# EAGLE design elderstep (EAGLE 8.3.2)
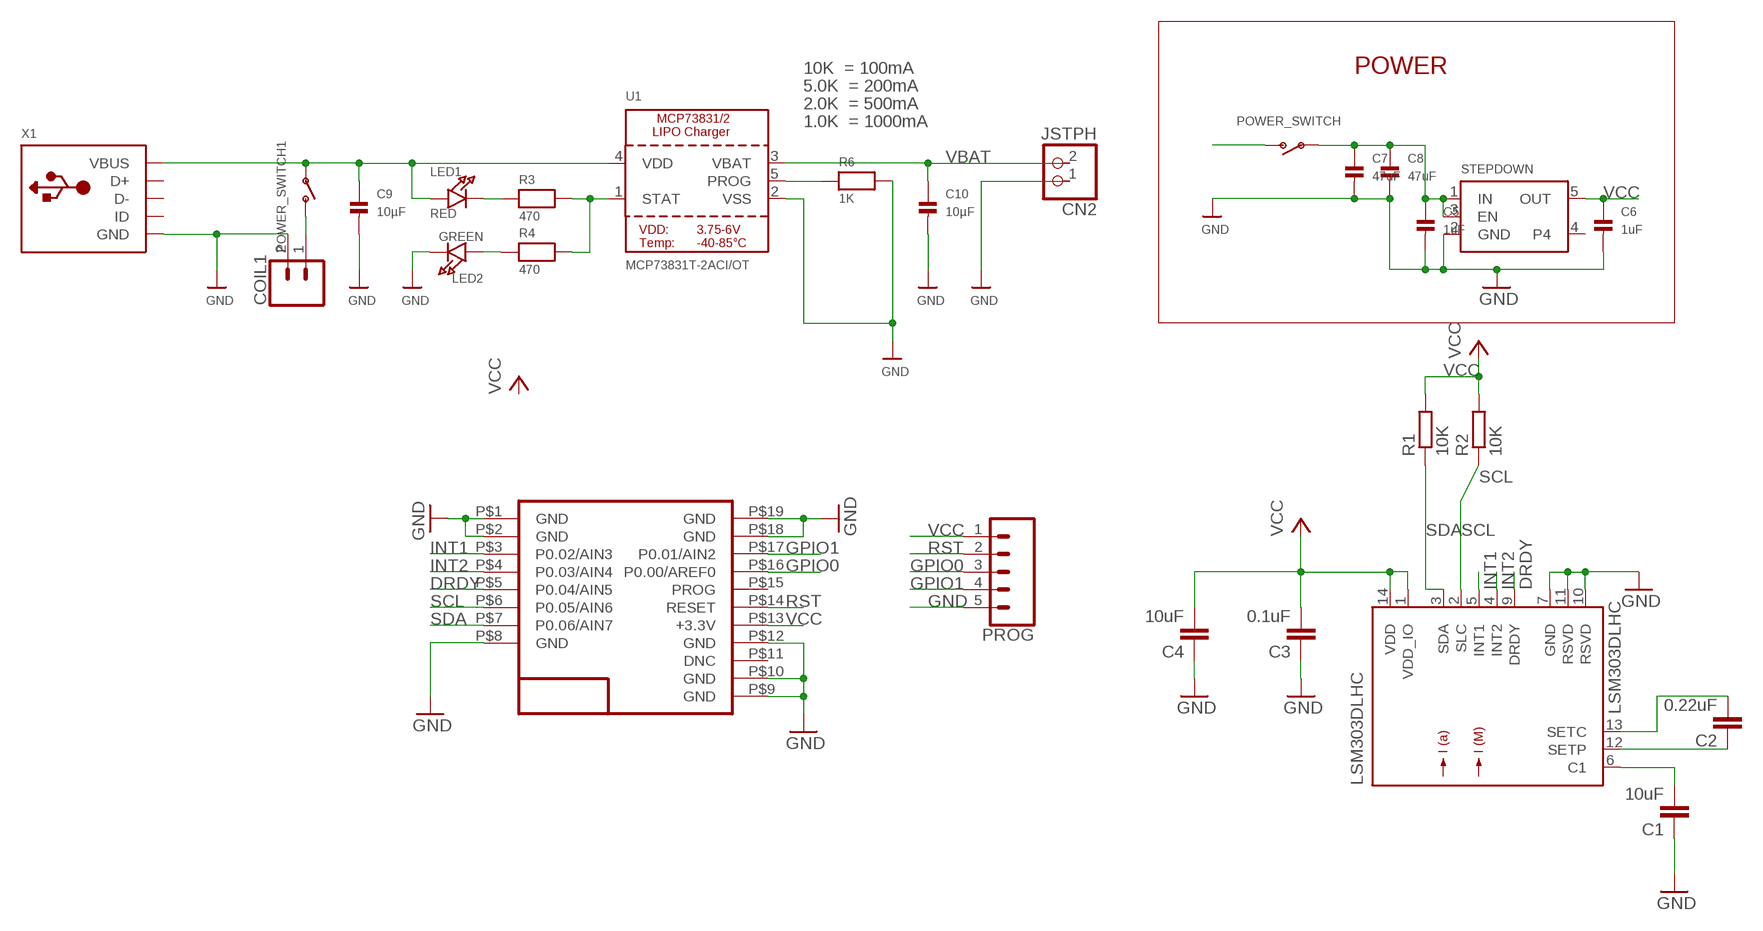
[diagram p0: schematic, sheet 1]

## Parts
C1  10uF  C-EUC0805  [C0805]
C2  0.22uF  C-EUC0805  [C0805]
C3  0.1uF  C-EUC0805  [C0805]
C4  10uF  C-EUC0805  [C0805]
C5  1uF  CAP_CERAMIC0603  [0603]
C6  1uF  CAP_CERAMIC0603  [0603]
C7  47uF  CAP_CERAMIC0805  [0805]
C8  47uF  CAP_CERAMIC0805  [0805]
C9  10µF  CAP_CERAMIC0805  [0805]
C10  10µF  CAP_CERAMIC0805  [0805]
CN2  JSTPH  JST_2PIN  [JSTPH2]
COIL1  CONN_02  [1X02]
LED1  RED  LED0805  [CHIPLED_0805]
LED2  GREEN  LED0805  [CHIPLED_0805]
LSM303DLHC  LSM303DLHC  [LGA-14]
POWER_SWITCH  SWITCH_SPST  [SPST_SMT_19192]
POWER_SWITCH1  SWITCH_SPST  [SPST_SMT_19192]
PROG  CONN_05  [1X05]
R1  10K  R-EU_R0805  [R0805]
R2  10K  R-EU_R0805  [R0805]
R3  470  RESISTOR0805  [0805]
R4  470  RESISTOR0805  [0805]
R6  1K  RESISTOR0805  [0805]
RFD22301  RFD22301  [RFD21733]
STEPDOWN  VREG_SOT23-5  [SOT23-5]
U1  MCP73831T-2ACI/OT  MCP73831/2  [SOT23-5]
X1  USBMICRO_20329  [4UCONN_20329]

## Nets
DRDY: LSM303DLHC.9(DRDY) RFD22301.P$5(P0.04/AIN5)
GND: C1.1 C3.1 C4.1 C5.2 C6.2 C7.2 C8.2 C9.2 C10.2 CN2.1 COIL1.2 LED2.C LSM303DLHC.7(GND) LSM303DLHC.10(RSVD) LSM303DLHC.11(RSVD) PROG.5 R6.2 RFD22301.P$1(GND) RFD22301.P$2(GND) RFD22301.P$8(GND) RFD22301.P$9(GND) RFD22301.P$10(GND) RFD22301.P$12(GND) RFD22301.P$18(GND) RFD22301.P$19(GND) STEPDOWN.2(GND) U1.2(VSS) X1.BASE@1(GND) X1.BASE@2(GND) X1.GND X1.SPRT@1(GND) X1.SPRT@2(GND) X1.SPRT@3(GND) X1.SPRT@4(GND)
GPIO0: PROG.3 RFD22301.P$16(P0.00/AREF0)
GPIO1: PROG.4 RFD22301.P$17(P0.01/AIN2)
INT1: LSM303DLHC.5(INT1) RFD22301.P$3(P0.02/AIN3)
INT2: LSM303DLHC.4(INT2) RFD22301.P$4(P0.03/AIN4)
N$1: LED1.C R3.1
N$2: R3.2 R4.2 U1.1(STAT)
N$3: C1.2 LSM303DLHC.6(C1)
N$4: C2.2 LSM303DLHC.13(SETC)
N$5: C2.1 LSM303DLHC.12(SETP)
N$6: R6.1 U1.5(PROG)
N$7: LED2.A R4.1
N$8: COIL1.1 POWER_SWITCH1.C(S)
RST: PROG.2 RFD22301.P$14(RESET)
SCL: LSM303DLHC.2(SLC) R2.1 RFD22301.P$6(P0.05/AIN6)
SDA: LSM303DLHC.3(SDA) R1.1 RFD22301.P$7(P0.06/AIN7)
SWITCH_OUT: C5.1 C7.1 C8.1 POWER_SWITCH.B(P) STEPDOWN.1(IN) STEPDOWN.3(EN)
VBAT: C10.1 CN2.2 POWER_SWITCH.C(S) U1.3(VBAT)
VCC: C3.2 C4.2 C6.1 LSM303DLHC.1(VDD_IO) LSM303DLHC.14(VDD) PROG.1 R1.2 R2.2 RFD22301.P$13(+3.3V) STEPDOWN.5(OUT)
VDD: C9.1 LED1.A POWER_SWITCH1.B(P) U1.4(VDD) X1.VBUS
Unconnected: RFD22301.P$11(DNC) RFD22301.P$15(PROG) STEPDOWN.4 X1.D+ X1.D- X1.ID

## Notes on the sheet
- 10K  = 100mA | POWER
- 5.0K  = 200mA
- 2.0K  = 500mA
- 1.0K  = 1000mA

## Library data of the parts
C1-C4 = rcl:C-EU: CAPACITOR, European symbol
C5-C10 = microbuilder:CAP_CERAMIC: Ceramic Capacitors 0402 - 0402 Surface Mount Capacitors 16pF 50V 5% [Digikey: 445-4899-2-ND] 18pF 50V 5% [Digikey: 490-1281-2-ND] 22pF 50V 5% [Digikey: 490-1283-2-ND] 68pF 50V 5% [Digikey: 490-1289-2-ND] 0.1uF 10V 10% [Digikey: 490-1318-2-ND] 1.0uF 6.3V 10% [Digikey: 490-1320-2-ND] 0603 - 0603 Surface Mount Capacitors 16 pF 50V 5% [Digikey: 445-5051-2-ND] 22 pF 50V [Digikey: PCC220ACVTR-ND] 33 pF 50V 5% [Digikey: 490-1415-1-ND] 56pF 50V 5% [Digikey: 490-1421-1-ND] 220pF 50V 5% [Digikey: 445-1285-1-ND] 680 pF 50V 2200 pF 50V 5% C0G [Digikey: 445-1297-1-ND] 5600 pF 100V 5% X7R [Digikey: 478-3711-1-ND] 0.1 µF 25V 10% [Digikey: PCC2277TR-ND] 0.22 µF 16V 10% X7R [Digikey: 445-1318-1-ND] 1.0 µF 25V 10% [Digikey: 445-5146-2-ND] 0603 - RF Specific 3pF 250V +/-0.1pF RF [Digikey: 712-1347-1-ND] 18 pF 250V 5% [Digikey: 478-3505-1-ND or 712-1322-1-ND] 56 pF 250V 5% C0G RF [Digikey: 490-4867-1-ND] 68 pF 250V RF [Digikey: 490-4868-1-ND] 0805 - 0805 Surface Mount Capacitors 220 pF 250V 2% RF Ceramic Capacitor [Digikey: 712-1398-1-ND] 1000 pF 50V 2% NP0 Ceramic Capacitor [Digikey: 478-3760-1-ND] 0.1 µF 25V 10% Ceramic Capacitor [Digikey: PCC1828TR-ND] 1.0 µF 16V 10% Ceramic Capacitor[Digikey: 490-1691-2-ND] 10.0 µF 10V 10% Ceramic Capacitor[Digikey: 709-1228-1-ND] 10.0 uF 16V 10% Ceramic Capacitor [Digikey: 478-5165-2-ND] 47 uF 6.3V 20% Ceramic Capacitor [Digikey: 587-1779-1-ND or 399-5506-1-ND] 1206 - 1206 Surface Mount Capacitors 47uF 10V 20% Ceramic Capacitor [Digikey: 490-5528-1-ND or 399-5508-1-ND or 445-6010-1-ND] 100uF 6.3V -20%, +80% Y5V Ceramic Capacitor (Digikey: 490-4512-1-ND, Mouser: 81-GRM31CF50J107ZE1L)
CN2 = microbuilder:JST_2PIN: JST 2-Pin Right-Angle Connector PH-Series - 4UConnector: 17311 SH-Series - 4UConnector: 07278
COIL1 = SparkFun-Connectors:CONN_02: Multi connection point. Often used as Generic Header-pin footprint for 0.1 inch spaced/style header connections On any of the 0.1 inch spaced packages, you can populate with these: Break Away Headers - Straight <https://www.sparkfun.com/products/116> (PRT-00116) Break Away Male Headers - Right Angle <https://www.sparkfun.com/products/553> (PRT-00553) Female Headers <https://www.sparkfun.com/products/115> (PRT-00115) Break Away Headers - Machine Pin <https://www.sparkfun.com/products/117> (PRT-00117) Break Away Female Headers - Swiss Machine Pin <https://www.sparkfun.com/products/743> (PRT-00743) For SCREWTERMINALS and SPRING TERMINALS visit here: Screw Terimnals on SparkFun.com <https://www.sparkfun.com/search/results?term=Screw+Terminals> (5mm/3.5mm/2.54mm spacing) This device is also useful as a general connection point to wire up your design to another part of your project. Our various solder wires solder well into these plated through hole pads. Hook-Up Wire - Assortment (Stranded, 22 AWG) <https://www.sparkfun.com/products/11375> (PRT-11375) Hook-Up Wire - Assortment (Solid Core, 22 AWG) <https://www.sparkfun.com/products/11367> (PRT-11367) View the entire wire category on our website here <https://www.sparkfun.com/categories/141> Special notes: Molex polarized connector foot print use with: PRT-08233 with associated crimp pins and housings. 2.54_SCREWTERM for use with PRT-10571. 3.5mm Screw Terminal footprints for PRT-08084 5mm Screw Terminal footprints for use with PRT-08432
LED1 LED2 = microbuilder:LED: LED 0603 - 0603 Surface Mount Package 2mA: Green LED - Low Power (3.9mcd, 2ma, 1.7Vf) - Digikey: 475-2709-2-ND Orange LED - Low Power (9.8mcd, 2ma, 1.8Vf) - Digikey: 475-1194-2-ND Red LED - Low Power (5mcd, 2ma, 1.8Vf) - Digikey: 475-1195-2-ND Yellow LED - Low Power (7mcd, 2ma, 1.8Vf) - Digikey: 475-1196-2-ND 5mA: Blue LED - Low Power (17mcd, 5ma, 2.9Vf) - Digikey: LNJ937W8CRACT-ND 0805 - 0805 Surface Mount Package 2mA: Red LED (8.8mcd, 2mA, 1.8Vf, Clear) - Low Power [Digikey: 475-2510-1-ND] Green LED (5mcd, 2mA, 1.8Vf, Clear) - Low Power [Digikey: 475-2730-1-ND] Yellow LED (11.3mcd, 2mA, 1.8Vf, Clear) - Low Power [Digikey: 475-2555-1-ND] 20mA: Red LED (104mcd, 20mA, Diffused) - LS R976 [Digikey: 475-1278-6-ND] Red LED (12mcd, 20mA, 2.0Vf, Clear) - APT2012EC [Digikey: 754-1128-1-ND] Green LED (15mcd, 20mA, 2.2Vf, Clear) - APT2012GC [Digikey: 754-1131-1-ND] Orange LED (160mcd, 20mA, 2.1Vf, Clear) - APT2012SECK [Digikey: 754-1130-1-ND] 1206 - 1206 Surface Mount Package Green LED (26mcd, 20mA, Diffused) - LG N971 [Digikey: 475-1407-6-ND] Red LED (15mcd, 20mA, Diffused) - LH N974 [Digikey: 475-1416-6-ND] Cree - Cree High-Power Surface Mount LEDs XPEBWT-L1-0000-00D50 - White 111lm 350mA 2.9Vf 6200K 110° XTEAWT-00-0000-00000LEE3 - White 114lm 350mA 2.85Vf 5000K 115°
LSM303DLHC = st-microelectronics:LSM303DLHC: Ultra compact high performance e-compass, 3D accelerometer and 3D magnetometer module Source: DM00027543-118326.pdf
POWER_SWITCH POWER_SWITCH1 = microbuilder:SWITCH_SPST: Switch - SPST 4UCon 19192 (6.7x2.6mm SMT)
PROG = SparkFun-Connectors:CONN_05: Multi connection point. Often used as Generic Header-pin footprint for 0.1 inch spaced/style header connections On any of the 0.1 inch spaced packages, you can populate with these: Break Away Headers - Straight <https://www.sparkfun.com/products/116> (PRT-00116) Break Away Male Headers - Right Angle <https://www.sparkfun.com/products/553> (PRT-00553) Female Headers <https://www.sparkfun.com/products/115> (PRT-00115) Break Away Headers - Machine Pin <https://www.sparkfun.com/products/117> (PRT-00117) Break Away Female Headers - Swiss Machine Pin <https://www.sparkfun.com/products/743> (PRT-00743) For SCREWTERMINALS and SPRING TERMINALS visit here: Screw Terimnals on SparkFun.com <https://www.sparkfun.com/search/results?term=Screw+Terminals> (5mm/3.5mm/2.54mm spacing) This device is also useful as a general connection point to wire up your design to another part of your project. Our various solder wires solder well into these plated through hole pads. Hook-Up Wire - Assortment (Stranded, 22 AWG) <https://www.sparkfun.com/products/11375> (PRT-11375) Hook-Up Wire - Assortment (Solid Core, 22 AWG) <https://www.sparkfun.com/products/11367> (PRT-11367) View the entire wire category on our website here <https://www.sparkfun.com/categories/141> Special notes: Molex polarized connector foot print use with SKU : PRT-08231 with associated crimp pins and housings. 1MM SMD Version SKU: PRT-10208
R1 R2 = resistor:R-EU_: RESISTOR, European symbol
R3 R4 R6 = microbuilder:RESISTOR: Resistors 0402 - 0402 Surface Mount Package 22 Ohm 1% 1/16W [Digikey: 311-22.0LRTR-ND] 33 Ohm 5% 1/16W 1.0K 5% 1/16W 1.5K 5% 1/16W 2.0K 1% 1/16W 10.0K 1% 1/16W [Digikey: 311-10.0KLRTR-ND] 10.0K 5% 1/16W [Digikey: RMCF0402JT10K0TR-ND] 12.1K 1% 1/16W [Digikey: 311-22.0LRTR-ND] 100.0K 5% 1/16W 0603 - 0603 Surface Mount Package 0 Ohm 1/10 Watt 1% Resistor 15 Ohm 1/10 Watt 1% Resistor 33 Ohm 1/10 Watt 1% Resistor 49.9 Ohm 1/10 Watt 1% Resistor 100 Ohm 1/10 Watt 1% Resistor 150 Ohm 1/10 Watt 1% Resistor 240 Ohm 1/10 Watt 1% Resistor 390 Ohm 1/10 Watt 1% Resistor 560 Ohm 1/10 Watt 1% Resistor 680 Ohm 1/10 Watt 1% Resistor 750 Ohm 1/10 Watt 1% Resistor 1.0K Ohm 1/10 Watt 1% Resistor 1.5K Ohm 1/10 Watt 1% Resistor 2.0K Ohm 1/10 Watt 1% Resistor 2.2K Ohm 1/10 Watt 1% Resistor 3.3K Ohm 1/10 Watt 1% Resistor 4.7K Ohm 1/10 Watt 1% Resistor 10.0K Ohm 1/10 Watt 1% Resistor 12.0K Ohm 1/10 Watt 1% Resistor 12.1K Ohm 1/10 Watt 1% Resistor 20.0K Ohm 1/10 Watt 1% Resistor 33.0K Ohm 1/10 Watt 1% Resistor 100.0K Ohm 1/10 Watt 1% Resistor 0805 - 0805 Surface Mount Package 0 Ohm 1/8 Watt 1% Resistor 33 Ohm 1/8 Watt 1% Resistor 100 Ohm 1/8 Watt 1% Resistor 150 Ohm 1/8 Watt 1% Resistor 200 Ohm 1/8 Watt 1% Resistor 240 Ohm 1/8 Watt 1% Resistor 330 Ohm 1/8 Watt 1% Resistor 390 Ohm 1/8 Watt 1% Resistor 470 Ohm 1/8 Watt 1% Resistor 1.0K Ohm 1/8 Watt 1% Resistor 1.5K Ohm 1/8 Watt 1% Resistor 2.0K Ohm 1/8 Watt 1% Resistor 4.7K Ohm 1/8 Watt 1% Resistor 5.1K Ohm 1/8 Watt 1% Resistor 5.6K Ohm 1/8 Watt 1% Resistor 10.0K Ohm 1/8 Watt 1% Resistor 22.0K Ohm 1/8 Watt 1% Resistor 33.0K Ohm 1/8 Watt 1% Resistor 100K Ohm 1/8 Watt 1% Resistor 1206 - 1206 Surface Mount Package 2012 - 2010 Surface Mount Package 0.11 Ohm 1/2 Watt 1% Resistor - Digikey: RHM.11UCT-ND
RFD22301 = RFD22301-11.25.13:RFD22301: RF Digital RFD22301
STEPDOWN = microbuilder:VREG_SOT23-5: SOT23-5 Fixed Voltage Regulators To better organise some of the SOT23-5 fixed voltage regulators in this library, this new part was created. Part Current Out V Out V In V Dropout Digikey Part No. ADP121 150mA 3.3V 3.4-5.5V 0.09V @ 150mA ADP121-AUJZ33R7CT-ND ADP121 150mA 3.0V 3.1-5.5V 0.09V @ 150mA ADP121-AUJZ30R7CT-ND ADP122 300mA 3.3V 3.4-5.5V 0.085V @ 300mA ADP122AUJZ-3.3-R7CT-ND ADP1712 300mA 3.3V 3.5-5.5V 0.17V @ 300mA ADP1712AUJZ-3.3-R7TR-ND AP7311 (Low Cost) 150mA 3.3V 3.5-6V 0.15V @ 150mA AP7311-33WG-7DICT-ND LD39015M18R 150mA 1.8V 1.9V-5.5V 0.08V @ 100mA 497-6977-1-ND MCP1824T-3302E/OT 300mA 3.3V 3.5V-6V 0.2V @ 300mA MCP1824T-3302E/OTCT-ND MIC5205-2.5YM5 TR 150mA 2.5V 2.7-16V 0.165V @ 150mA 576-1257-2-ND MIC5205-3.0YM5 TR 150mA 3.0V 3.2V-16V 0.165V @ 150mA 576-1258-2-ND MIC5205-3.3YM5 TR 150mA 3.3V 3.5V-16V 0.165V @ 150mA 576-1259-2-ND TPS780330220 150mA 3.3V+2.2V 3.6-5.5V 250mV Max 296-23332-1-ND TDA3663/N1,135 100mA 3.3V 3.5-45V 0.18V @ 50mA 568-5343-1-ND
U1 = microbuilder:MCP73831/2: MCP73831/2 LIPO Charger VDD: 3.75 - 6V Temp -40 - 85°C Programmable Charge Rate: 15-500mA NOTE: STAT is a tri-state logic output on the MCP73831 and an open-drain output on the MCP73832. SOT23-5 with 4.2V output and tri-state logic on STAT = MCP73831T-2ACI/OT
X1 = microbuilder:USB: USB Connectors USBMINIB - Surface Mount Female Mini-B USB Connector 4UConnector: 06564

## Board
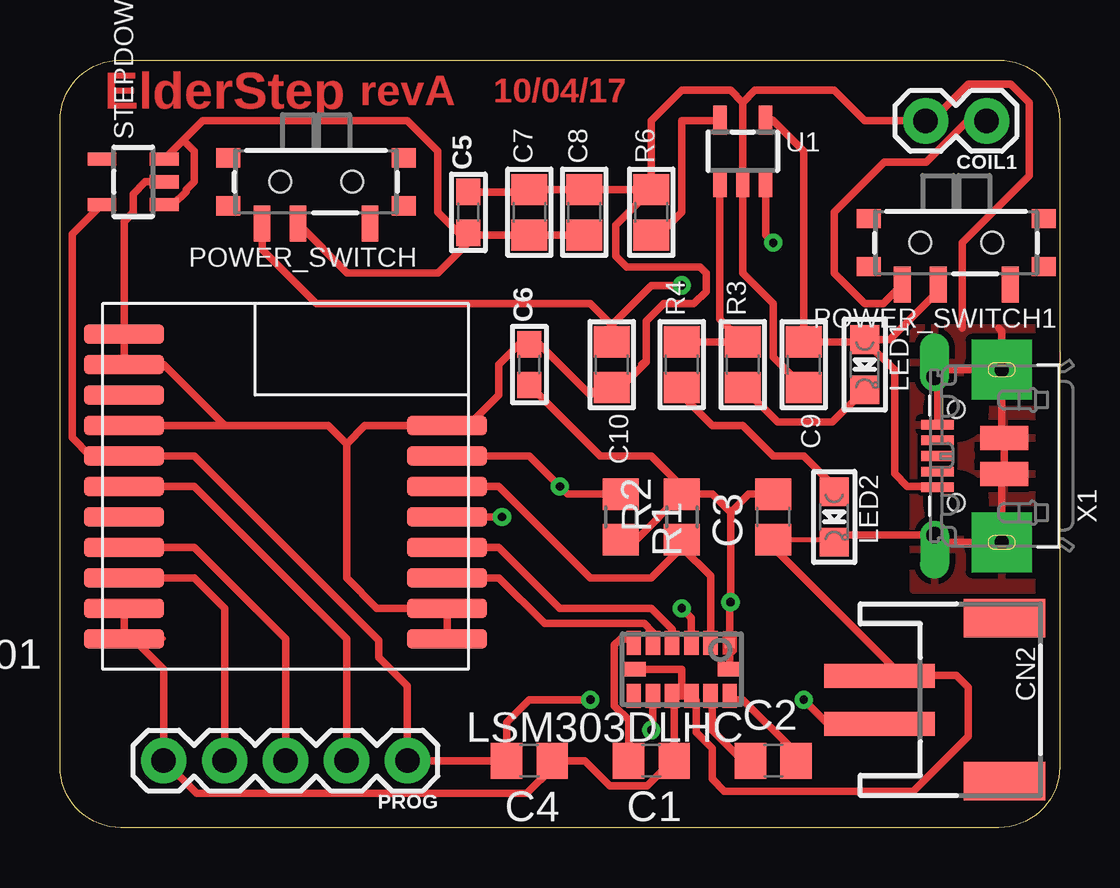
[diagram p1: board, top side]
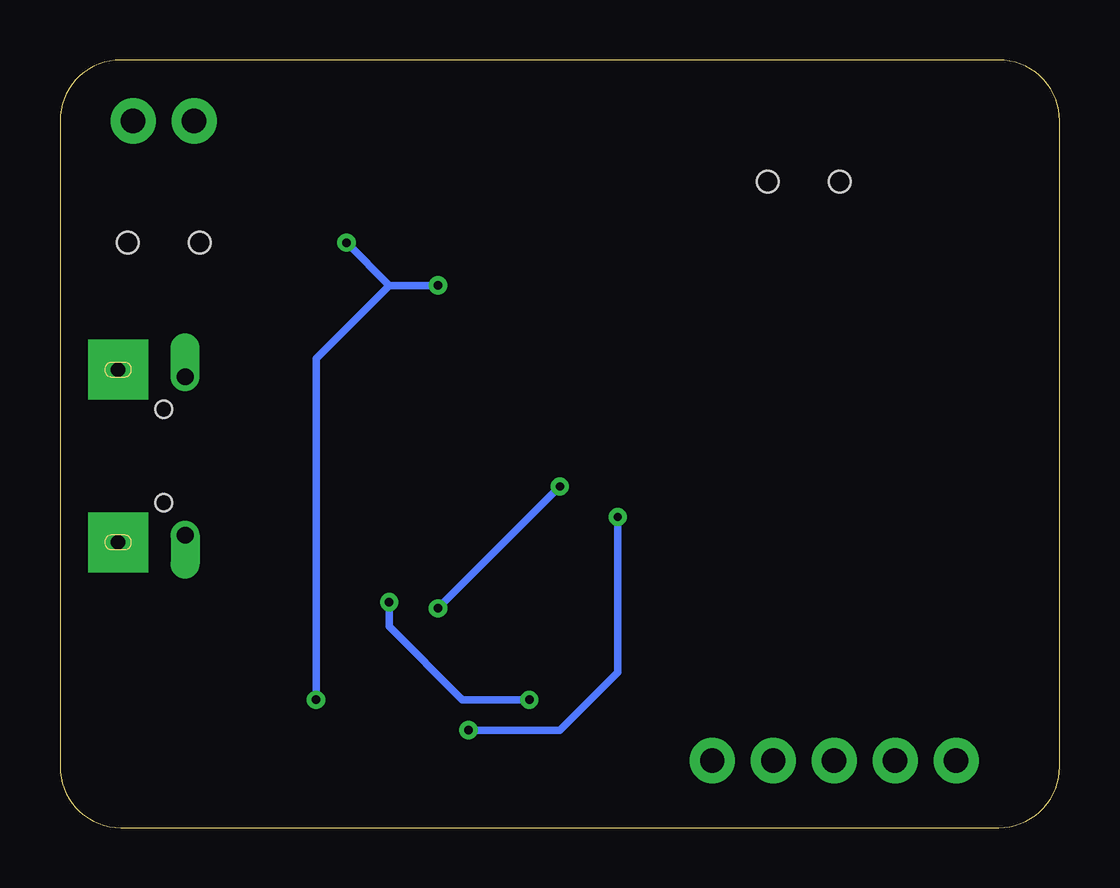
[diagram p2: board, bottom side, seen from below]

Size 41.66 x 32 mm. Coordinates in mm from the lower left corner, seen from the top.
Outline: 41.66,29.46 41.66,2.54 arc-90 39.12,0 2.54,0 arc-90 0,2.54 0,29.46 arc-90 2.54,32 39.12,32 arc-90 41.66,29.46
Copper layers (1*16): Top 0.035mm / dielectric 1.5mm / Bottom 0.035mm
Design rules "default": minimum track width 6mil, minimum drill 0.35mm, track to track 6mil, track to pad 6mil, pad to pad 6mil, via to via 6mil, smd to smd 6mil, copper to edge 40mil, drill to drill 6mil, minimum pad ring 10mil, minimum via ring 8mil, stop-mask expansion 4mil, vias tented up to drill 0mil, thermal gap 10mil

### Footprints (pad centres in the part's own frame; a part is rotated, then mirrored left to right if it is on the bottom)
C0805 = smd 1.3 x 1.5: 1 -0.95,0; 2 0.95,0
0603 = smd 1.1 x 1: 1 -0.85,0; 2 0.85,0
0805 = smd 1.3 x 1.5: 1 -0.95,0; 2 0.95,0
JSTPH2 = smd 1 x 4.6: 1 -1,-3.7; 2 1,-3.7 | smd 1.6 x 3.4: NC1 -3.4,1.5; NC2 3.4,1.5
1X02 = drill 1.016 pad 1.88: 1 0,0; 2 2.54,0
CHIPLED_0805 = smd 1.2 x 1.2: A 0,-1.05; C 0,1.05
LGA-14 = smd 0.4 x 0.4: 1 -2,-1.1 | smd 0.6 x 1: 2 -1.2,-1.1; 3 -0.4,-1.1; 4 0.4,-1.1; 5 1.2,-1.1; 6 2,-1.1; 8 2,1.1; 9 1.2,1.1; 10 0.4,1.1; 11 -0.4,1.1; 12 -1.2,1.1; 13 -2,1.1 | smd 1 x 0.6: 7 2,0; 14 -2,0
SPST_SMT_19192 = smd 0.7 x 1.5: A -2.25,1.75; B 0.75,1.75; C 2.25,1.75 | smd 1 x 0.8: GND1 -3.65,1; GND2 -3.65,-1; GND3 3.65,1; GND4 3.65,-1 | hole 0.9: -1.5,0; 1.5,0
1X05 = drill 1.016 pad 1.88: 1 0,0; 2 2.54,0; 3 5.08,0; 4 7.62,0; 5 10.16,0
R0805 = smd 1.3 x 1.5: 1 -0.95,0; 2 0.95,0
RFD21733 = smd 3.353 x 0.813: P$1 -6.731,6.35; P$2 -6.731,5.08; P$3 -6.731,3.81; P$4 -6.731,2.54; P$5 -6.731,1.27; P$6 -6.731,0; P$7 -6.731,-1.27; P$8 -6.731,-2.54; P$9 6.731,-6.35; P$10 6.731,-5.08; P$11 6.731,-3.81; P$12 6.731,-2.54; P$13 6.731,-1.27; P$14 6.731,0; P$15 6.731,1.27; P$16 6.731,2.54; P$17 6.731,3.81; P$18 6.731,5.08; P$19 6.731,6.35
SOT23-5 = smd 0.55 x 1.2: 1 -0.95,-1.3; 2 0,-1.3; 3 0.95,-1.3; 4 0.95,1.3; 5 -0.95,1.3
4UCONN_20329 = smd 1 x 2: BASE@1 -0.75,-2; BASE@2 0.75,-2 | smd 0.4 x 1.35: D+ 0,0.775; D- -0.65,0.775; GND 1.3,0.775; ID 0.65,0.775; VBUS -1.3,0.775 | drill 0.7 offset: SPRT@1 -3.3,0.9; SPRT@2 3.3,0.9 | drill 0.6 pad 2.5 square: SPRT@3 -3.6,-1.9; SPRT@4 3.6,-1.9 | hole 0.7: -1.95,0; 1.95,0

### Placement (x,y rotation side)
C1  24.64,2.79 180 top
C2  29.72,2.79 0 top
C3  29.72,12.95 90 top
C4  19.56,2.79 180 top
C5  17.02,25.65 90 top
C6  19.56,19.3 90 top
C7  19.56,25.65 90 top
C8  21.84,25.65 90 top
C9  30.99,19.3 270 top
C10  22.99,19.3 270 top
CN2  37.85,5.33 270 top
COIL1  38.61,29.46 180 top
LED1  33.53,19.3 180 top
LED2  32.26,12.95 180 top
LSM303DLHC  25.91,6.6 180 top
POWER_SWITCH  10.67,26.92 180 top
POWER_SWITCH1  37.34,24.38 180 top
PROG  14.48,2.79 180 top
R1  23.37,12.95 270 top
R2  25.91,12.95 90 top
R3  28.45,19.3 90 top
R4  25.91,19.3 90 top
R6  24.64,25.65 90 top
RFD22301  9.4,14.22 180 top
STEPDOWN  3.05,26.92 90 top
U1  28.45,28.19 0 top
X1  37.34,15.49 90 top

### Tracks (layer width: path | path; a pad name or v marks a point on that pad's centre or on a via)
DRDY  (via drill 0.35)
  Top 0.305: LSM303DLHC.9 24.71,4.13 v24.64,4.06 | RFD22301.P$5 v18.41,12.95
  Bottom 0.305: v24.64,4.06 20.83,4.06 18.41,6.48 v18.41,12.95
GND
  Top 0.203: 32.55,12.19 LED2.C 32.16,12 C3.1 29.72,11.68 | 19.14,20.15 C6.2 19.98,20.15 | RFD22301.P$8 17.02,16.76 | 23.05,18.03 C10.2 | RFD22301.P$19 3.05,7.87 4.32,7.87
  Top 0.305: RFD22301.P$1 RFD22301.P$2 13.21,9.14 11.94,10.41 11.94,16 | 32.55,12.19 X1.SPRT@1 36.74,11.89 X1.SPRT@3 | 19.14,20.15 18.29,19.3 18.29,18.03 17.02,16.76 | 19.98,20.15 22.1,18.03 22.42,18.35 C10.2 | RFD22301.P$18 RFD22301.P$19 | 3.05,7.87 4.32,6.6 PROG.5 5.69,1.42 19.46,1.42 20.51,2.47 C4.1 21.86,2.79 22.73,1.92 22.91,1.74 24.46,1.74 25.52,2.79 C1.1 25.59,5.42 | C5.2 19.46,26.5 C7.2 C8.2 R6.2 | C9.2 29.72,19.62 29.72,21.84 28.45,23.11 U1.2 28.45,30.23 | COIL1.2 33.53,29.46 32.26,30.73 28.96,30.73 28.45,30.23 | R6.2 24.64,29.46 25.91,30.73 27.94,30.73 28.45,30.23 | 25.59,5.42 LSM303DLHC.10 | 25.91,5.5 LSM303DLHC.11 26.5,5.31 26.5,3.98 27.18,3.3 27.18,2.03 27.69,1.52 35.56,1.52 37.85,3.81 37.85,5.84 37.34,6.35 34.67,6.35 CN2.1 34.91,6.49 29.72,11.68 | 25.91,5.5 25.67,5.5 25.59,5.42 | LSM303DLHC.7 25.91,6.6 25.91,5.5 | 24.24,19.3 24.42,19.48 | R6.2 23.15,25.12 23.15,23.84 23.62,23.37 26.67,23.37 26.92,23.11 26.92,22.35 26.42,21.84 25.15,21.84 24.42,21.12 24.42,19.48 | 24.42,19.48 24.42,19.41 23.05,18.03 | COIL1.2 36.85,29.46 | 39.34,18.99 X1.SPRT@4 | X1.GND 36.56,18.67 X1.SPRT@2 36.74,19.09 X1.SPRT@4 | 38.3,11.89 X1.SPRT@3 | STEPDOWN.2 3.56,26.92 3.05,26.42 3.05,25.65 2.67,25.27 RFD22301.P$9 RFD22301.P$10 4.32,19.3 6.86,16.76 | X1.SPRT@3 39.24,14.64 X1.BASE@1 X1.BASE@2 39.24,16.34 X1.SPRT@4 | X1.SPRT@4 39.24,20.71 39.12,20.83 | COIL1.2 36.32,29.46 37.85,30.99 39.62,30.99 40.39,30.23 40.39,27.18 37.59,24.38 37.59,20.83 | 11.94,16 11.18,16.76 6.86,16.76 | 6.86,16.76 RFD22301.P$12 | 11.94,16 12.7,16.76 RFD22301.P$8
  pour Top: 35.56,20.83 41.15,20.83 41.15,9.91 35.56,9.91
GPIO0
  Top 0.305: PROG.3 9.4,7.87 5.59,11.68 RFD22301.P$16
GPIO1
  Top 0.305: PROG.4 6.86,9.14 5.59,10.41 RFD22301.P$17
INT1
  Top 0.305: RFD22301.P$3 18.29,10.41 20.19,8.51 24.33,8.51 24.71,8.13 LSM303DLHC.5
INT2
  Top 0.305: LSM303DLHC.4 25.51,8.27 24.64,9.14 20.83,9.14 18.29,11.68 RFD22301.P$4
N$1
  Top 0.305: LED1.C 32.18,16.91 29.9,16.91 R3.1
N$2
  Top 0.305: R4.2 R3.2 27.5,21.2 U1.1
N$3
  Top 0.305: C1.2 23.69,4.49 23.1,5.08 23.1,7.61 23.37,7.87 23.74,7.87 LSM303DLHC.6
N$4
  Top 0.305: C2.2 30.67,3.11 28.45,5.33 28.08,5.33 LSM303DLHC.13
N$5
  Top 0.305: C2.1 28.45,2.79 27.18,4.06 27.18,5.43 LSM303DLHC.12
N$6
  Top 0.305: R6.1 24.96,24.7 25.91,25.65 25.91,29.46 27.47,29.46 U1.5
N$7
  Top 0.305: R4.1 25.91,18.03 27.18,16.76 28.45,16.76 29.72,15.49 30.99,15.49 32.26,14.22 LED2.A
N$8
  Top 0.305: COIL1.1 37.83,29.46 36.1,27.74 34.34,27.74 32.26,25.65 32.26,23.11 33.53,21.84 34.3,21.84 POWER_SWITCH1.C
RST
  Top 0.305: PROG.2 11.94,7.87 5.59,14.22 RFD22301.P$14
SCL
  Top 0.203: 25.91,11.68 R2.1
  Top 0.305: RFD22301.P$6 18.29,14.22 22.1,10.41 24.64,10.41 25.91,11.68 27.11,10.48 LSM303DLHC.2
SDA  (via drill 0.35)
  Top 0.305: LSM303DLHC.3 26.31,8.74 v25.91,9.14 | R1.1 21.15,13.9 v20.83,14.22 19.56,15.49 RFD22301.P$7
  Bottom 0.305: v20.83,14.22 v25.91,9.14
SWITCH_OUT
  Top 0.305: POWER_SWITCH.B 11.98,23.11 15.75,23.11 17.02,24.38 17.02,24.6 17.12,24.7 | 17.12,24.7 C5.1 16.6,24.8 15.75,25.65 15.75,28.19 14.48,29.46 5.94,29.46 5.13,28.65 | 5.13,28.65 STEPDOWN.3 | STEPDOWN.1 4.7,25.97 5.25,26.52 5.25,26.59 5.59,26.92 5.59,28.19 5.13,28.65 | 17.12,24.7 C7.1 C8.1
VBAT  (via drill 0.35)
  Top 0.305: v25.91,22.61 24.64,22.61 22.99,20.96 | U1.3 29.4,24.7 v29.72,24.38 | CN2.2 31.99,4.33 v30.99,5.33 | POWER_SWITCH.C 8.42,24.09 10.67,21.84 22.1,21.84 22.99,20.96 | C10.1 22.99,20.96
  Bottom 0.305: v25.91,22.61 27.94,22.61 | 27.94,22.61 v29.72,24.38 | 27.94,22.61 30.99,19.56 v30.99,5.33
VCC  (via drill 0.35)
  Top 0.203: R1.2 24.01,12 | R2.2 25.91,14.22
  Top 0.305: 24.01,12 R2.2 27.18,13.9 27.94,13.14 | 25.91,14.22 24.64,15.49 22.52,15.49 C6.1 | STEPDOWN.5 0.51,24.73 0.51,16.26 1.27,15.49 RFD22301.P$13 5.59,15.49 13.28,7.8 13.28,7.1 14.48,5.91 PROG.1 C4.2 18.61,4.38 19.56,5.33 v22.1,5.33 | 27.94,13.14 v27.94,9.4 27.91,9.37 LSM303DLHC.1 LSM303DLHC.14 | C3.2 28.7,13.9 27.94,13.14
  Bottom 0.305: v22.1,5.33 24.89,5.33 27.94,8.38 v27.94,9.4
VDD
  Top 0.203: POWER_SWITCH1.B 36.59,22.36 | 33.53,20.32 LED1.A
  Top 0.305: LED1.A 34.58,20.35 36.59,22.36 | U1.4 29.69,29.49 30.99,28.19 C9.1 33.47,20.25 33.53,20.32 34.77,19.07 34.77,14.76 35.31,14.22 35.87,14.22 35.9,14.19 X1.VBUS

### Text on the board
Top: ElderStep | revA | 10/04/17